# Altium project midithru.PrjPcb
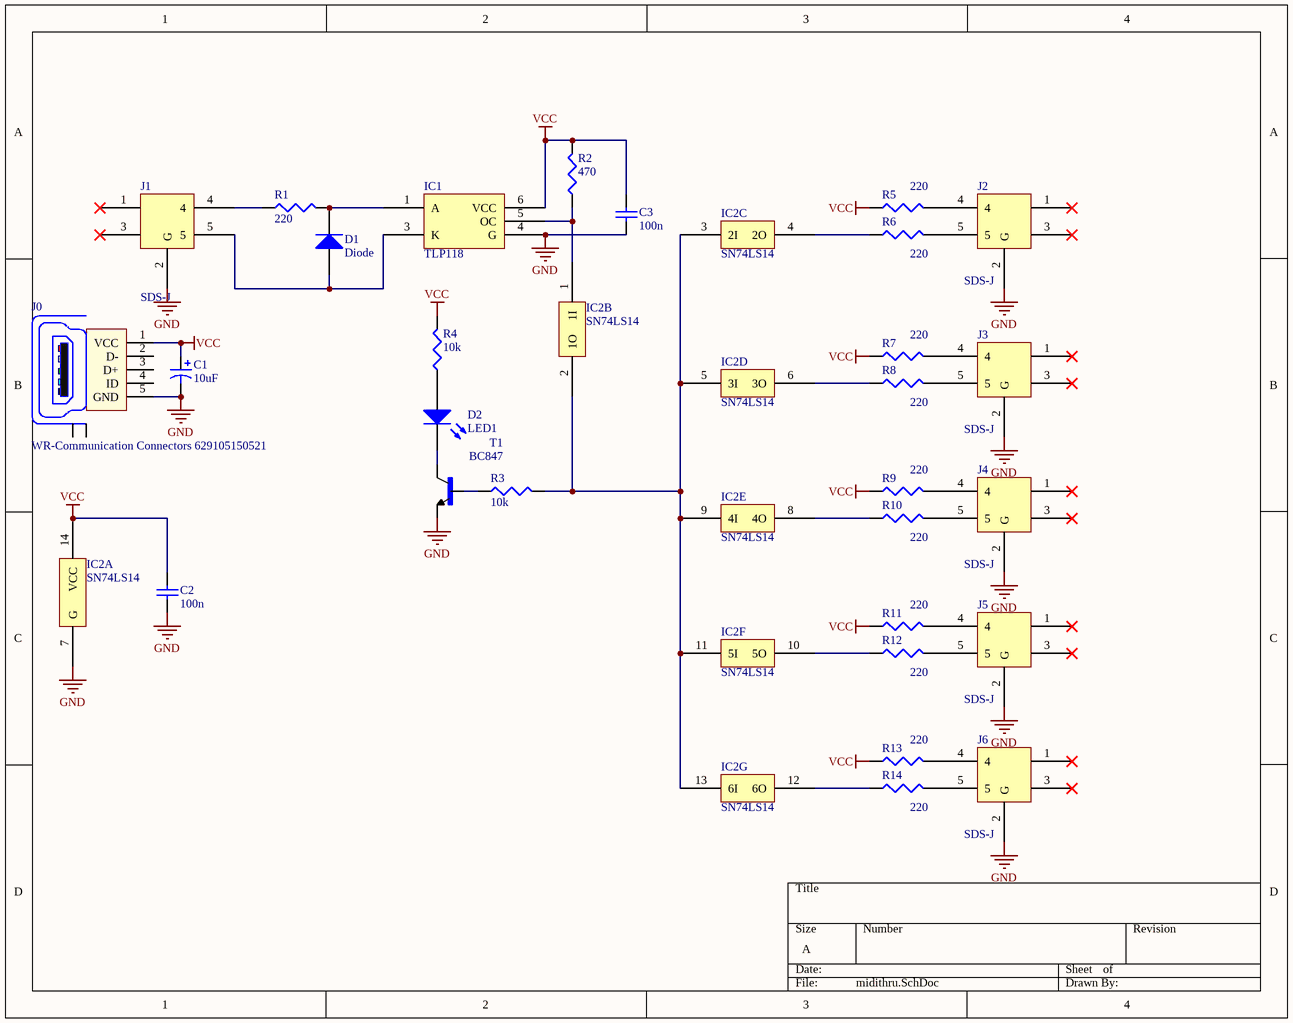
[diagram p0: midithru.SchDoc]
1 sheet, 29 parts. Net scope: global (net labels, ports and power ports of the same name join across sheets).
Board file: midithru.PcbDoc

## Sheet midithru.SchDoc
size A

### Parts
C1  10uF  [1210]
C2  100n  [0805]
C3  100n  [0805]
D1  Diode  [0805]
D2  LED1  [3.2X1.6X1.1]
IC1  TLP118  [SOIC6]
IC2  SN74LS14  [SOIC14]  (parts A,B,C,D,E,F,G of 7)
J0  WR-Communication Connectors 629105150521  [629105150521]
J1  SDS-J  [SDS-J]
J2  SDS-J  [SDS-J]
J3  SDS-J  [SDS-J]
J4  SDS-J  [SDS-J]
J5  SDS-J  [SDS-J]
J6  SDS-J  [SDS-J]
R1  220  [0805]
R2  470  [0805]
R3  10k  [0805]
R4  10k  [0805]
R5  220  [0805]
R6  220  [0805]
R7  220  [0805]
R8  220  [0805]
R9  220  [0805]
R10  220  [0805]
R11  220  [0805]
R12  220  [0805]
R13  220  [0805]
R14  220  [0805]
T1  BC847  [*SOT23]

### Nets
GND: C1.2 C2.2 C3.2 IC1.4(G) IC2.7(G) J0.5(GND) J1.2(G) J2.2(G) J3.2(G) J4.2(G) J5.2(G) J6.2(G) T1.2(E)
VCC: C1.1 C2.1 C3.1 IC1.6(VCC) IC2.14(VCC) J0.1(VCC) R2.2 R4.2 R5.1 R7.1 R9.1 R11.1 R13.1
NetD1_1: D1.1(A) IC1.3(K) J1.5
NetD1_2: D1.2(K) IC1.1(A) R1.2
NetD2_1: D2.1(A) R4.1
NetD2_2: D2.2(K) T1.3(C)
NetIC1_5: IC1.5(OC) IC2.1(1I) R2.1
NetIC2_2: IC2.2(1O) IC2.3(2I) IC2.5(3I) IC2.9(4I) IC2.11(5I) IC2.13(6I) R3.2
NetIC2_4: IC2.4(2O) R6.1
NetIC2_6: IC2.6(3O) R8.1
NetIC2_8: IC2.8(4O) R10.1
NetIC2_10: IC2.10(5O) R12.1
NetIC2_12: IC2.12(6O) R14.1
NetJ1_4: J1.4 R1.1
NetJ2_4: J2.4 R5.2
NetJ2_5: J2.5 R6.2
NetJ3_4: J3.4 R7.2
NetJ3_5: J3.5 R8.2
NetJ4_4: J4.4 R9.2
NetJ4_5: J4.5 R10.2
NetJ5_4: J5.4 R11.2
NetJ5_5: J5.5 R12.2
NetJ6_4: J6.4 R13.2
NetJ6_5: J6.5 R14.2
NetR3_1: R3.1 T1.1(B)

Not connected (* = marked no-connect by the designer): J0 2(D-) 3(D+) 4(ID) Z1(Shield) Z2(Shield); J1 1* 3*; J2 1* 3*; J3 1* 3*; J4 1* 3*; J5 1* 3*; J6 1* 3*

### Library data of the parts
C1 = Cap Pol3: Polarized Capacitor (Surface Mount); Published: 8-Jun-2000; LatestRevisionDate: 29-May-2009; LatestRevisionNote: IPC-7351 Footprint Added.; PackageReference: C0805; Publisher: Altium Limited; PackageDescription: Chip Capacitor; Value: 10uF
C2 C3 = Cap Semi: Capacitor (Semiconductor SIM Model); Value: 100pF; Published: 8-Jun-2000; LatestRevisionDate: 29-May-2009; LatestRevisionNote: IPC-7351 Footprint Added.; PackageReference: C1206; Publisher: Altium Limited; PackageDescription: Chip Capacitor
D1 = Diode: Default Diode; Published: 8-Jun-2000; LatestRevisionDate: 17-Jul-2002; LatestRevisionNote: Re-released for DXP Platform.; PackageVersion: Sep-1996; PackageReference: SMC; Publisher: Altium Limited; PackageDescription: DO-214-AB/SMC; 2 C-Bend Leads; Body 7.9 x 5.9 mm, inc. leads (LxW); Code_JEDEC: DO-214-AB
D2 = LED2: Typical RED, GREEN, YELLOW, AMBER GaAs LED; Published: 8-Jun-2000; LatestRevisionDate: 17-Jul-2002; LatestRevisionNote: Re-released for DXP Platform.; PackageVersion: Feb-2002; PackageReference: 3.2X1.6X1.1; Publisher: Altium Limited; PackageDescription: SM LED; 2 Flat Leads
J0 = WR-Communication Connectors 629105150521: WR-COM_USB_Micro Type B_Horizontal_SMT; Manufacturer: Würth Elektronik eiSos GmbH; ComponentLink1 Description: Manufacturer; ComponentLink2 Description: Datasheet; NoPins: 5; ComponentLink1URL: http://www.we-online.de; ComponentLink2URL: http://katalog.we-online.de/em/datasheet/629105150521.pdf; Created by: Karrer Zheng; Created Date: 10/21/2014; partNo: 629105150521
R1-R14 = Res3: Resistor; Value: 1K; Published: 8-Jun-2000; LatestRevisionDate: 29-May-2009; LatestRevisionNote: IPC-7351 Footprint Added.; PackageReference: J1-0603; Publisher: Altium Limited; PackageDescription: Chip Resistor
T1 = BC847: MF: Nexperia USA; SnapEDA_Link: https://www.snapeda.com/parts/BC847/Nexperia%20USA%20Inc./view-part/?ref=snap; Availability: Unavailable; Price: None; Package: SOT-323 Rectron; MP: BC847; Value: *